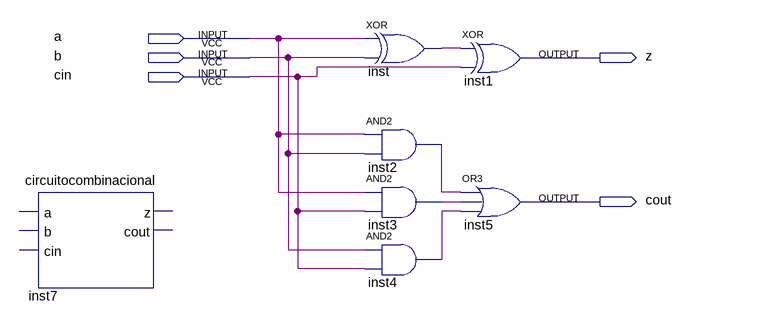
[diagram p0: schematic sheet]
// Quartus schematic BloqueComb.bdf as structural Verilog: 7 symbols, 5 pins
module BloqueComb (
  input  a,
  input  b,
  input  cin,
  output z,
  output cout
);

  wire inst2_out, inst3_out, inst4_out, inst_out;

  circuitocombinacional inst7 ();  // open: a, b, cin, z, cout
  xor inst (inst_out, a, b);
  and inst2 (inst2_out, a, b);
  and inst3 (inst3_out, a, cin);
  and inst4 (inst4_out, b, cin);
  xor inst1 (z, inst_out, cin);
  or inst5 (cout, inst2_out, inst3_out, inst4_out);
endmodule
